# EAGLE design dmx_splitter (EAGLE 6.4)
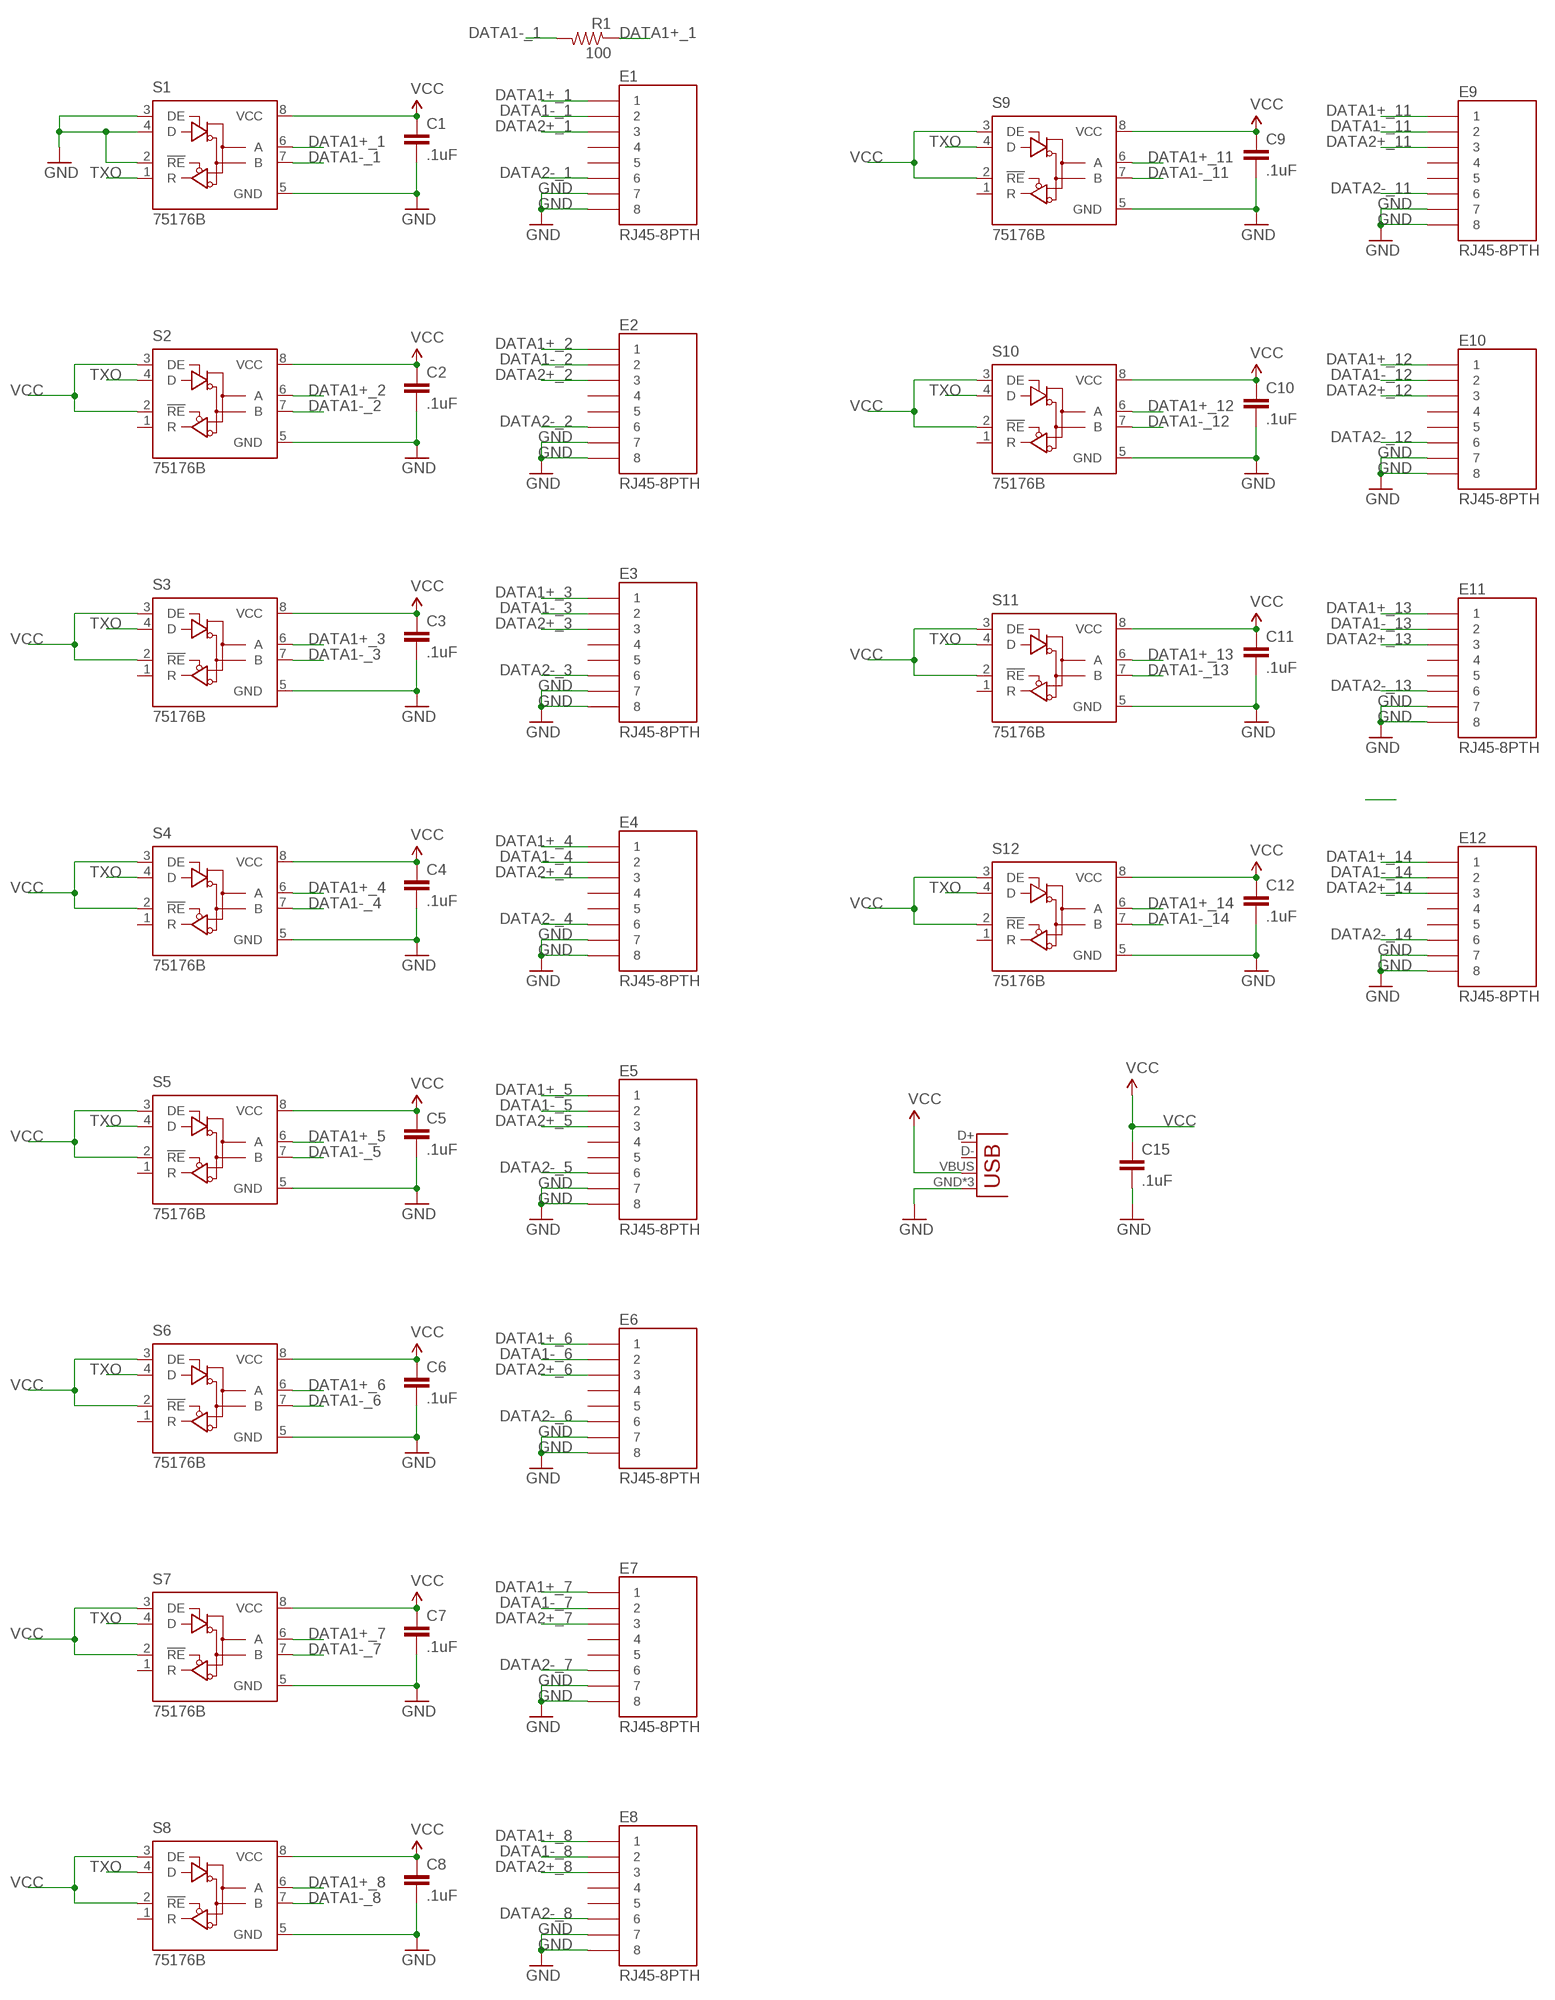
[diagram p0: schematic, sheet 1]

## Parts
C1  .1uF  CAP0402-CAP  [0402-CAP]
C2  .1uF  CAP0402-CAP  [0402-CAP]
C3  .1uF  CAP0402-CAP  [0402-CAP]
C4  .1uF  CAP0402-CAP  [0402-CAP]
C5  .1uF  CAP0402-CAP  [0402-CAP]
C6  .1uF  CAP0402-CAP  [0402-CAP]
C7  .1uF  CAP0402-CAP  [0402-CAP]
C8  .1uF  CAP0402-CAP  [0402-CAP]
C9  .1uF  CAP0402-CAP  [0402-CAP]
C10  .1uF  CAP0402-CAP  [0402-CAP]
C11  .1uF  CAP0402-CAP  [0402-CAP]
C12  .1uF  CAP0402-CAP  [0402-CAP]
C15  .1uF  CAP0402-CAP  [0402-CAP]
E1  RJ45-8PTH  [RJ45-8]
E2  RJ45-8PTH  [RJ45-8]
E3  RJ45-8PTH  [RJ45-8]
E4  RJ45-8PTH  [RJ45-8]
E5  RJ45-8PTH  [RJ45-8]
E6  RJ45-8PTH  [RJ45-8]
E7  RJ45-8PTH  [RJ45-8]
E8  RJ45-8PTH  [RJ45-8]
E9  RJ45-8PTH  [RJ45-8]
E10  RJ45-8PTH  [RJ45-8]
E11  RJ45-8PTH  [RJ45-8]
E12  RJ45-8PTH  [RJ45-8]
JP1  USB-MICROB  [USB-MICROB]
R1  100  RESISTOR1206  [1206]
S1  75176B  [D_R-PDSO-G8]
S2  75176B  [D_R-PDSO-G8]
S3  75176B  [D_R-PDSO-G8]
S4  75176B  [D_R-PDSO-G8]
S5  75176B  [D_R-PDSO-G8]
S6  75176B  [D_R-PDSO-G8]
S7  75176B  [D_R-PDSO-G8]
S8  75176B  [D_R-PDSO-G8]
S9  75176B  [D_R-PDSO-G8]
S10  75176B  [D_R-PDSO-G8]
S11  75176B  [D_R-PDSO-G8]
S12  75176B  [D_R-PDSO-G8]

## Nets
DATA1+_1: E1.1 R1.1 S1.6(A)
DATA1+_2: E2.1 S2.6(A)
DATA1+_3: E3.1 S3.6(A)
DATA1+_4: E4.1 S4.6(A)
DATA1+_5: E5.1 S5.6(A)
DATA1+_6: E6.1 S6.6(A)
DATA1+_7: E7.1 S7.6(A)
DATA1+_8: E8.1 S8.6(A)
DATA1+_11: E9.1 S9.6(A)
DATA1+_12: E10.1 S10.6(A)
DATA1+_13: E11.1 S11.6(A)
DATA1+_14: E12.1 S12.6(A)
DATA1-_1: E1.2 R1.2 S1.7(B)
DATA1-_2: E2.2 S2.7(B)
DATA1-_3: E3.2 S3.7(B)
DATA1-_4: E4.2 S4.7(B)
DATA1-_5: E5.2 S5.7(B)
DATA1-_6: E6.2 S6.7(B)
DATA1-_7: E7.2 S7.7(B)
DATA1-_8: E8.2 S8.7(B)
DATA1-_11: E9.2 S9.7(B)
DATA1-_12: E10.2 S10.7(B)
DATA1-_13: E11.2 S11.7(B)
DATA1-_14: E12.2 S12.7(B)
DATA2+_1: E1.3
DATA2+_2: E2.3
DATA2+_3: E3.3
DATA2+_4: E4.3
DATA2+_5: E5.3
DATA2+_6: E6.3
DATA2+_7: E7.3
DATA2+_8: E8.3
DATA2+_11: E9.3
DATA2+_12: E10.3
DATA2+_13: E11.3
DATA2+_14: E12.3
DATA2-_1: E1.6
DATA2-_2: E2.6
DATA2-_3: E3.6
DATA2-_4: E4.6
DATA2-_5: E5.6
DATA2-_6: E6.6
DATA2-_7: E7.6
DATA2-_8: E8.6
DATA2-_11: E9.6
DATA2-_12: E10.6
DATA2-_13: E11.6
DATA2-_14: E12.6
GND: C1.2 C2.2 C3.2 C4.2 C5.2 C6.2 C7.2 C8.2 C9.2 C10.2 C11.2 C12.2 C15.2 E1.7 E1.8 E2.7 E2.8 E3.7 E3.8 E4.7 E4.8 E5.7 E5.8 E6.7 E6.8 E7.7 E7.8 E8.7 E8.8 E9.7 E9.8 E10.7 E10.8 E11.7 E11.8 E12.7 E12.8 JP1.GND JP1.MT1(GND) JP1.MT2(GND) S1.2(!RE) S1.3(DE) S1.4(D) S1.5(GND) S2.5(GND) S3.5(GND) S4.5(GND) S5.5(GND) S6.5(GND) S7.5(GND) S8.5(GND) S9.5(GND) S10.5(GND) S11.5(GND) S12.5(GND)
TXO: S1.1(R) S2.4(D) S3.4(D) S4.4(D) S5.4(D) S6.4(D) S7.4(D) S8.4(D) S9.4(D) S10.4(D) S11.4(D) S12.4(D)
VCC: C1.1 C2.1 C3.1 C4.1 C5.1 C6.1 C7.1 C8.1 C9.1 C10.1 C11.1 C12.1 C15.1 JP1.VBUS S1.8(VCC) S2.2(!RE) S2.3(DE) S2.8(VCC) S3.2(!RE) S3.3(DE) S3.8(VCC) S4.2(!RE) S4.3(DE) S4.8(VCC) S5.2(!RE) S5.3(DE) S5.8(VCC) S6.2(!RE) S6.3(DE) S6.8(VCC) S7.2(!RE) S7.3(DE) S7.8(VCC) S8.2(!RE) S8.3(DE) S8.8(VCC) S9.2(!RE) S9.3(DE) S9.8(VCC) S10.2(!RE) S10.3(DE) S10.8(VCC) S11.2(!RE) S11.3(DE) S11.8(VCC) S12.2(!RE) S12.3(DE) S12.8(VCC)
Unconnected: E1.4 E1.5 E2.4 E2.5 E3.4 E3.5 E4.4 E4.5 E5.4 E5.5 E6.4 E6.5 E7.4 E7.5 E8.4 E8.5 E9.4 E9.5 E10.4 E10.5 E11.4 E11.5 E12.4 E12.5 JP1.D+ JP1.D- S2.1(R) S3.1(R) S4.1(R) S5.1(R) S6.1(R) S7.1(R) S8.1(R) S9.1(R) S10.1(R) S11.1(R) S12.1(R)

## Library data of the parts
C1-C12 C15 = SparkFun-Capacitors:CAP: Capacitor Standard 0603 ceramic capacitor, and 0.1" leaded capacitor.
E1-E12 = SparkFun-Connectors:RJ45-8: RJ45 Jack Simple RJ45, 8-pin connection - connector for common Cat5, Cat5e, and Cat6 Ethernet cables. Footprint not yet proven in production. Connector sku is PRT-00643; Breakout PCB sku is BOB-00716.
JP1 = SparkFun-Connectors:USB: USB Connectors USB-B-PTH is fully proven SKU : PRT-00139/CONN-08278 USB-miniB is fully proven SKU : PRT-00587 USB-A-PCB is untested. USB-A-H is throughly reviewed, but untested. Spark Fun Electronics SKU : PRT-00437 USB-B-SMT is throughly reviewed, but untested. Needs silkscreen touching up. USB-A-S has not been used/tested USB-MB-H has not been used/tested USB-MICROB has been used. CONN-09505; PROD_ID: CONN-09505
R1 = SparkFun-Passives:RESISTOR: Resistor Basic schematic elements and footprints for 0603, 1206, and PTH resistors.
S1-S12 = 751xx:75176B: 75176B

## Net classes
1 vcc: width 0.254 mm

## Board
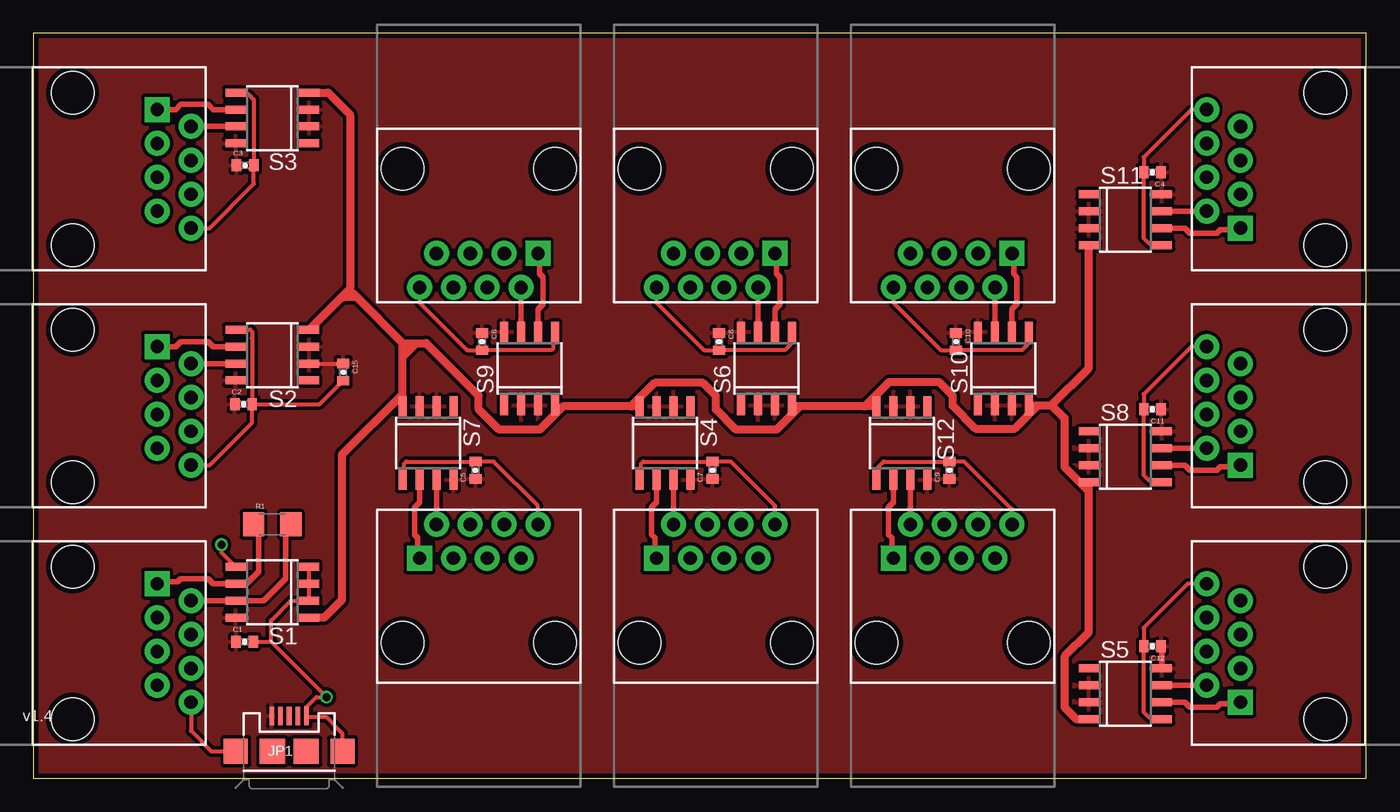
[diagram p1: board, top side]
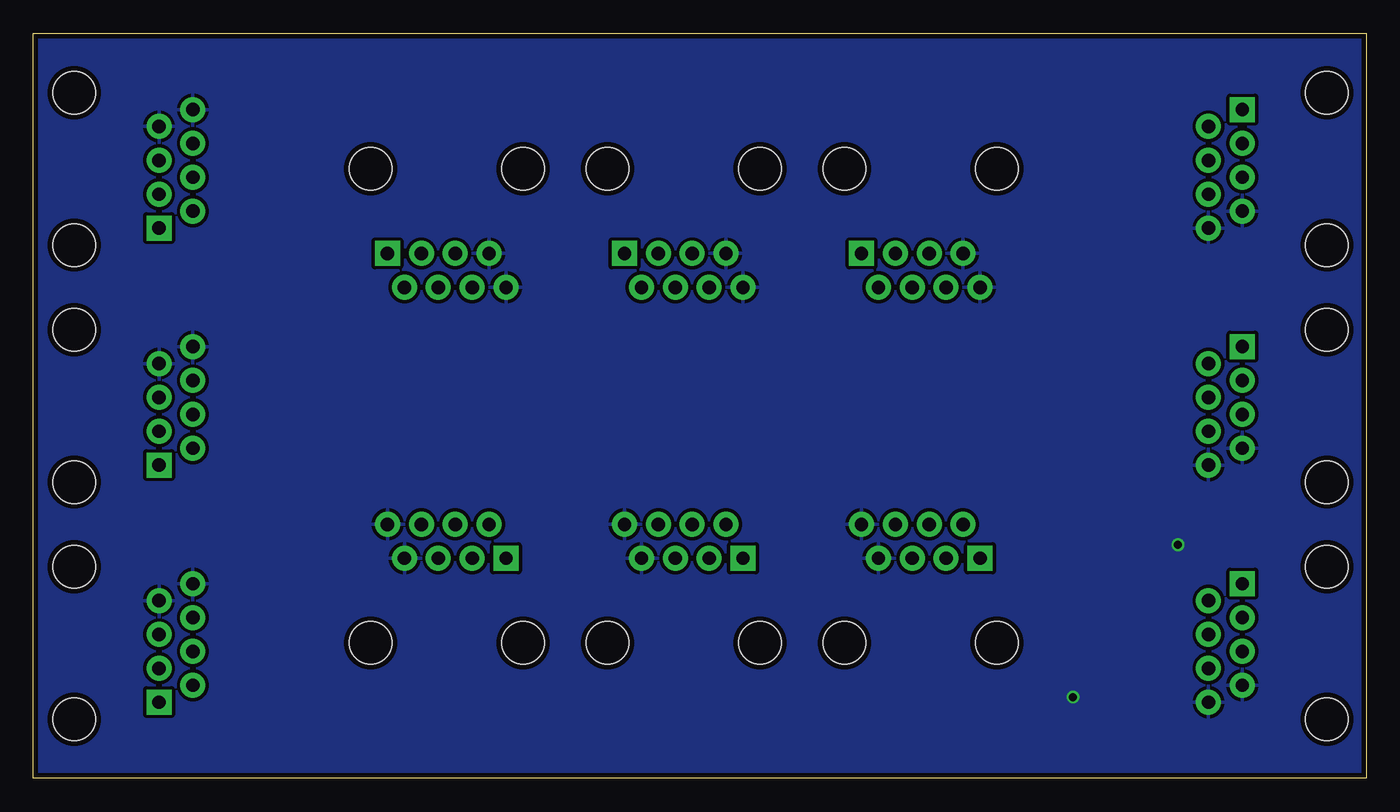
[diagram p2: board, bottom side, seen from below]

Size 100 x 55.88 mm. Coordinates in mm from the lower left corner, seen from the top.
Outline: 0,0 100,0 100,55.88 0,55.88 0,0
Copper layers (1*16): Top 0.0356mm / dielectric 1.5011mm / Bottom 0.0356mm
Design rules "LaenPCBOrder *": minimum track width 6mil, minimum drill 13mil, track to track 10mil, track to pad 6mil, pad to pad 6mil, via to via 6mil, smd to smd 6mil, copper to edge 15mil, drill to drill 6mil, minimum pad ring 7mil, minimum via ring 7mil, stop-mask expansion 4mil, vias tented up to drill 0mil, thermal gap 10mil

### Footprints (pad centres in the part's own frame; a part is rotated, then mirrored left to right if it is on the bottom)
0402-CAP = smd 0.7 x 0.9: 1 -0.65,0; 2 0.65,0
RJ45-8 = drill 1 pad 1.88 square: 1 -4.445,6.35 | drill 1 pad 1.88: 2 -3.175,8.89; 3 -1.905,6.35; 4 -0.635,8.89; 5 0.635,6.35; 6 1.905,8.89; 7 3.175,6.35; 8 4.445,8.89 | hole 3.2: -5.715,0; 5.715,0
USB-MICROB = smd 0.35 x 1.4: D+ 0,2.65; D- -0.65,2.65; GND 1.3,2.65; ID 0.65,2.65; VBUS -1.3,2.65 | smd 1.8 x 1.9: MT1 -4,0; MT2 4,0 | smd 1.9 x 1.9: P$1 -1.27,0; P$2 1.27,0
1206 = smd 1.6 x 1.8: 1 -1.4,0; 2 1.4,0
D_R-PDSO-G8 = smd 0.6 x 1.5: 1 -1.905,-2.75; 2 -0.635,-2.75; 3 0.635,-2.75; 4 1.905,-2.75; 5 1.905,2.75; 6 0.635,2.75; 7 -0.635,2.75; 8 -1.905,2.75

### Placement (x,y rotation side)
C1  15.86,10.26 0 top
C2  15.77,28.07 0 top
C3  15.89,45.97 0 top
C4  83.97,45.47 180 top
C5  33.17,23.11 90 top
C6  33.67,32.77 270 top
C7  50.95,23.11 90 top
C8  51.45,32.77 270 top
C9  68.73,23.11 90 top
C10  69.23,32.77 270 top
C11  83.97,27.69 180 top
C12  83.97,9.91 180 top
C15  23.26,30.48 270 top
E1  2.94,10.16 270 top
E2  2.94,27.94 270 top
E3  2.94,45.72 270 top
E4  51.2,10.16 0 top
E5  96.92,10.16 90 top
E6  51.2,45.72 180 top
E7  33.42,10.16 0 top
E8  96.92,27.94 90 top
E9  33.42,45.72 180 top
E10  68.98,45.72 180 top
E11  96.92,45.72 90 top
E12  68.98,10.16 0 top
JP1  19.2,2.03 0 top
R1  17.93,19.05 0 top
S1  17.93,13.97 90 top
S2  17.93,31.75 90 top
S3  17.93,49.53 90 top
S4  47.39,25.15 180 top
S5  81.93,6.35 270 top
S6  55.01,30.73 0 top
S7  29.61,25.15 180 top
S8  81.93,24.13 270 top
S9  37.23,30.73 0 top
S10  72.79,30.73 0 top
S11  81.93,41.91 270 top
S12  65.17,25.15 180 top

### Tracks (layer width: path | path; a pad name or v marks a point on that pad's centre or on a via)
DATA1+_1
  Top 0.406: E1.1 9.42,14.73 10.81,14.73 11.07,14.99 13.1,14.99 13.48,14.61 S1.6 16.02,14.61 16.91,15.49 16.91,18.54 16.53,18.93 R1.1
DATA1+_2
  Top 0.406: E2.1 10.69,32.38 11.07,32.77 13.1,32.77 13.48,32.38 S2.6
DATA1+_3
  Top 0.406: E3.1 10.69,50.16 11.07,50.55 13.1,50.55 13.48,50.16 S3.6
DATA1+_4
  Top 0.406: E4.1 46.63,16.64 46.63,18.03 46.37,18.29 46.37,20.32 46.76,20.7 S4.6
DATA1+_5
  Top 0.406: E5.1 90.44,5.59 89.05,5.59 88.79,5.33 86.76,5.33 86.38,5.71 S5.6
DATA1+_6
  Top 0.406: E6.1 55.77,39.24 55.77,37.85 56.03,37.59 56.03,35.56 55.65,35.18 S6.6
DATA1+_7
  Top 0.406: E7.1 28.85,16.64 28.85,18.03 28.59,18.29 28.59,20.32 28.98,20.7 S7.6
DATA1+_8
  Top 0.406: E8.1 90.44,23.37 89.05,23.37 88.79,23.11 86.76,23.11 86.38,23.5 S8.6
DATA1+_11
  Top 0.406: E9.1 37.99,39.24 37.99,37.85 38.25,37.59 38.25,35.56 37.87,35.18 S9.6
DATA1+_12
  Top 0.406: E10.1 73.55,39.24 73.55,37.85 73.81,37.59 73.81,35.56 73.42,35.18 S10.6
DATA1+_13
  Top 0.406: E11.1 90.44,41.15 89.05,41.15 88.79,40.89 86.76,40.89 86.38,41.27 S11.6
DATA1+_14
  Top 0.406: E12.1 64.41,16.64 64.41,18.03 64.15,18.29 64.15,20.32 64.53,20.7 S12.6
DATA1-_1
  Top 0.406: E1.2 S1.7 17.29,13.34 18.94,14.99 18.94,18.67 R1.2
DATA1-_2
  Top 0.406: S2.7 E2.2
DATA1-_3
  Top 0.406: E3.2 S3.7
DATA1-_4
  Top 0.406: E4.2 S4.7
DATA1-_5
  Top 0.406: E5.2 S5.7
DATA1-_6
  Top 0.406: E6.2 S6.7
DATA1-_7
  Top 0.406: S7.7 E7.2
DATA1-_8
  Top 0.406: E8.2 S8.7
DATA1-_11
  Top 0.406: E9.2 S9.7
DATA1-_12
  Top 0.406: E10.2 S10.7
DATA1-_13
  Top 0.406: E11.2 S11.7
DATA1-_14
  Top 0.406: E12.2 S12.7
GND  (via drill 0.6)
  Top 0.305: JP1.MT2 23.2,3.37 21.99,4.57 20.61,4.57 JP1.GND 20.5,5.36 21.23,6.1 v21.99,6.1 17.83,10.26 | E1.8 11.83,3.56 13.35,2.03 JP1.MT1 | C1.2 17.83,10.26 | S1.4 S1.3 S1.2 19.32,13.34 17.83,11.84 17.83,10.26 | S1.5 14.12,16.93 v14.12,17.53 | E2.8 13.23,23.5 16.4,26.67 16.4,28.05 C2.2 | C2.2 21.5,28.07 C15.2 | S2.5 16.27,33.66 16.4,33.53 16.4,33.02 16.42,33.01 C2.2 | E3.8 13.23,41.27 16.54,44.59 C3.2 16.54,50.91 16.15,51.31 15.3,51.31 S3.5 | E7.8 37.87,20.45 34.55,23.76 C5.2 27.97,23.76 27.83,23.62 27.83,22.52 S7.5 | S9.5 39.01,33.36 39.01,32.26 38.87,32.12 C6.2 32.55,32.12 28.98,35.69 E9.8 | E4.8 55.65,20.45 52.33,23.76 C7.2 45.75,23.76 45.61,23.62 45.61,22.52 S4.5 | S6.5 56.79,33.36 56.79,32.51 56.39,32.12 C8.2 50.33,32.12 46.76,35.69 E6.8 | E10.8 64.53,35.69 68.11,32.12 C10.2 74.17,32.12 74.57,32.51 74.57,33.36 S10.5 | S12.5 63.39,22.52 63.39,23.37 63.79,23.76 C9.2 69.85,23.76 73.42,20.19 E12.8 | E8.8 86.89,32.38 83.32,28.81 C11.2 83.32,22.75 83.71,22.35 84.56,22.35 S8.5 | E5.8 86.63,14.61 83.32,11.29 C12.2 83.32,4.97 83.71,4.57 84.56,4.57 S5.5 | E11.8 86.89,50.16 83.32,46.59 C4.2 83.32,40.53 83.71,40.13 84.56,40.13 S11.5
  pour Bottom: -0.13,0 -0.13,55.88 104.14,55.88 101.6,0
N$1
  Top 0.61: 28.59,32.51 27.83,31.75
TXO
  Top 0.61: S3.4 22.12,51.44 23.77,49.78 23.77,36.75 23.68,36.66 | 23.68,36.66 S2.4 | S1.1 21.82,12.06 23.13,13.37 23.13,24.26 27.7,28.83 | S7.4 27.7,28.83 | 27.7,28.83 27.7,32.64 | 27.7,32.64 24.28,36.07 | 24.28,36.07 23.68,36.66 | S9.4 39.13,27.3 | 39.13,27.3 37.99,26.16 34.94,26.16 33.42,27.69 33.42,28.7 29.48,32.64 27.7,32.64 | S4.4 44.85,27.9 | 44.85,27.9 39.73,27.9 39.13,27.3 | 44.85,27.9 46.62,29.66 50.24,29.66 51.2,28.7 51.2,27.69 52.72,26.16 55.77,26.16 57.51,27.9 | S12.4 62.38,27.9 | 62.38,27.9 57.51,27.9 | 24.28,36.07 23.26,36.07 | 62.38,27.9 64.2,29.72 67.96,29.72 68.98,28.7 68.98,27.94 70.68,26.24 73.63,26.24 75.33,27.94 75.33,27.98 | 57.51,27.9 57,27.9 S6.4 | 74.78,27.98 S10.4 75.33,27.98 | 75.33,27.98 76.39,27.98 | 76.39,27.98 79.18,30.78 S11.4 | 76.39,27.98 77.36,27.01 77.36,23.37 79.14,21.59 | S8.4 79.14,22.18 79.14,21.59 | 79.14,21.59 79.14,10.92 77.36,9.14 77.36,5.33 78.25,4.45 S5.4
VCC
  Top 0.305: S2.2 23.25,31.11 C15.1
  Top 0.406: C12.1 84.68,9.84 S5.8
  pour Top: -16.26,66.8 117.09,66.8 117.09,-7.87 -16.26,-7.87 -16.26,66.55

### Text on the board
tPlace: v1.4